# EAGLE design SR_Presentation_Version (EAGLE 9.2.0)
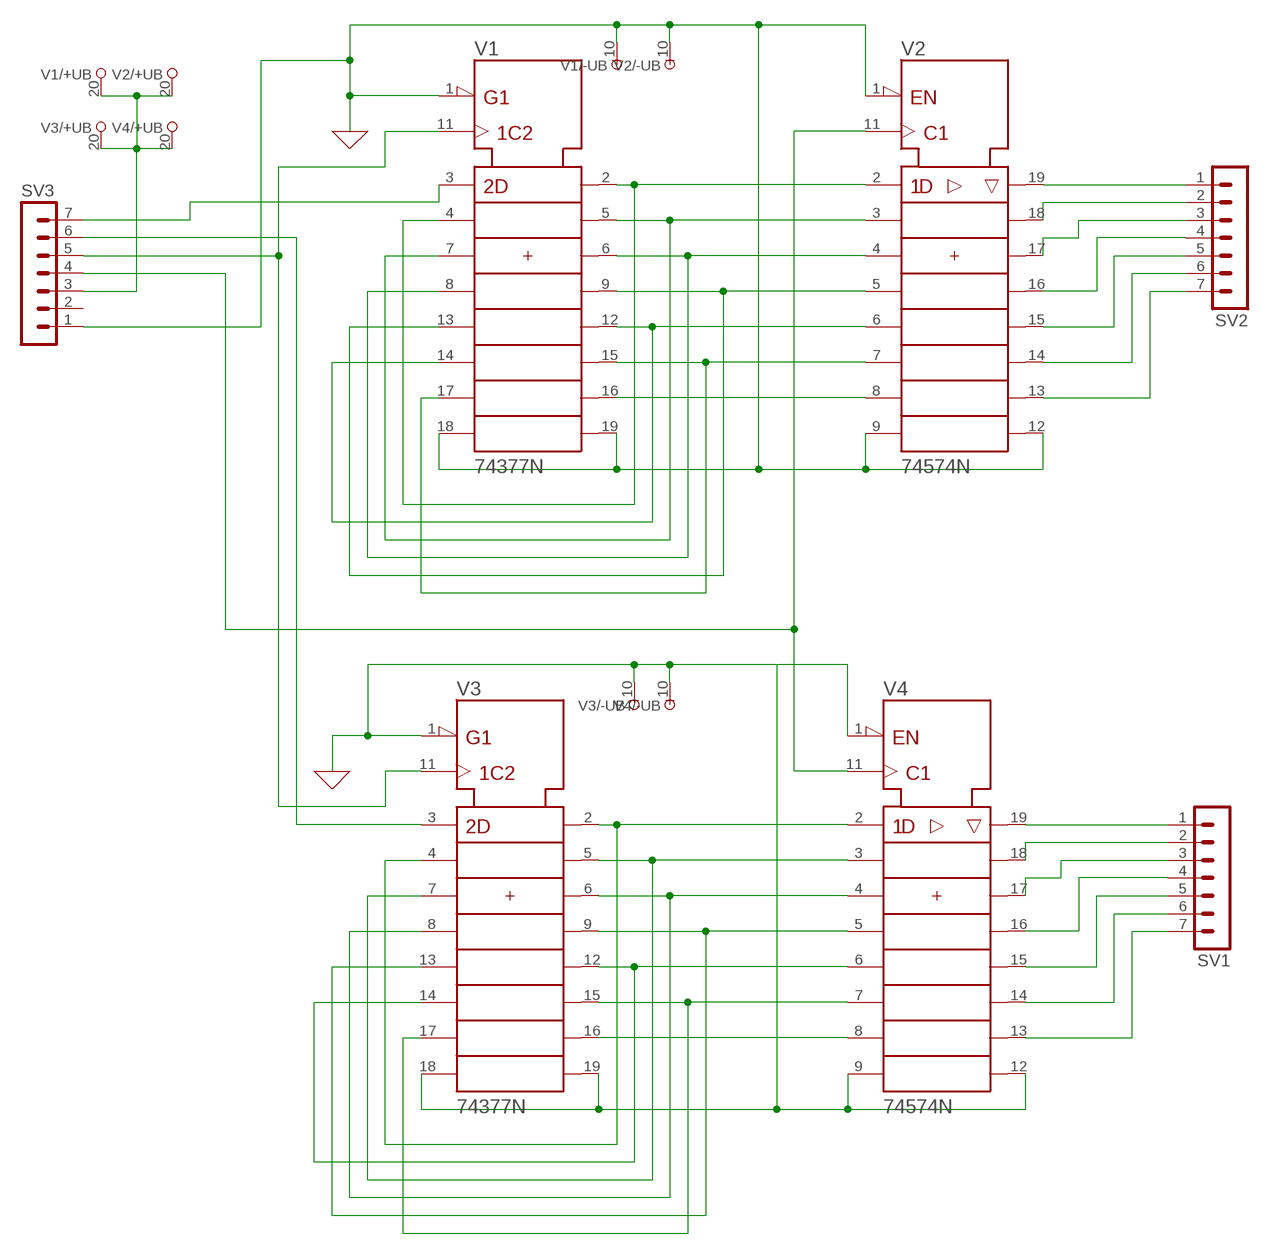
[diagram p0: schematic, sheet 1]

## Parts
SV1  MA07-1  [MA07-1]
SV2  MA07-1  [MA07-1]
SV3  MA07-1  [MA07-1]
V1  74377N  [DIL20]
V2  74574N  [DIL20]
V3  74377N  [DIL20]
V4  74574N  [DIL20]

## Nets
0: SV3.1 V1.1(!G) V1.10(-UB) V1.18(8D) V1.19(8Q) V2.1(!OC) V2.9(8D) V2.10(-UB) V2.12(8Q) V3.1(!G) V3.10(-UB) V3.18(8D) V3.19(8Q) V4.1(!OC) V4.9(8D) V4.10(-UB) V4.12(8Q) ; supply symbol labelled GND
N$1: V1.2(1Q) V1.4(2D) V2.2(1D)
N$2: V1.5(2Q) V1.7(3D) V2.3(2D)
N$3: V1.6(3Q) V1.8(4D) V2.4(3D)
N$4: V1.9(4Q) V1.13(5D) V2.5(4D)
N$5: V1.12(5Q) V1.14(6D) V2.6(5D)
N$6: V1.15(6Q) V1.17(7D) V2.7(6D)
N$7: V1.16(7Q) V2.8(7D)
N$8: SV3.3 V1.20(+UB) V2.20(+UB) V3.20(+UB) V4.20(+UB)
N$9: SV3.4 V2.11(CLK) V4.11(CLK)
N$11: SV2.1 V2.19(1Q)
N$12: SV2.2 V2.18(2Q)
N$13: SV2.3 V2.17(3Q)
N$14: SV2.4 V2.16(4Q)
N$15: SV2.5 V2.15(5Q)
N$16: SV2.6 V2.14(6Q)
N$17: SV2.7 V2.13(7Q)
N$18: V3.2(1Q) V3.4(2D) V4.2(1D)
N$19: V3.5(2Q) V3.7(3D) V4.3(2D)
N$20: V3.6(3Q) V3.8(4D) V4.4(3D)
N$21: V3.9(4Q) V3.13(5D) V4.5(4D)
N$22: V3.12(5Q) V3.14(6D) V4.6(5D)
N$23: V3.15(6Q) V3.17(7D) V4.7(6D)
N$24: V3.16(7Q) V4.8(7D)
N$25: SV1.1 V4.19(1Q)
N$26: SV1.2 V4.18(2Q)
N$27: SV1.3 V4.17(3Q)
N$28: SV1.4 V4.16(4Q)
N$29: SV1.5 V4.15(5Q)
N$30: SV1.6 V4.14(6Q)
N$31: SV1.7 V4.13(7Q)
N$32: SV3.7 V1.3(1D)
N$33: SV3.6 V3.3(1D)
N$36: SV3.5 V1.11(CLK) V3.11(CLK)
Unconnected: SV3.2

## Library data of the parts
SV1-SV3 = con-lstb:MA07-1: PIN HEADER; OC_FARNELL: unknown; OC_NEWARK: unknown
V1 V3 = 74ttl-din:74*377: Octal D type FLIP FLOP, enable
V2 V4 = 74ttl-din:74*574: 8-bit D type FLIP FLOP bus driver

## Board
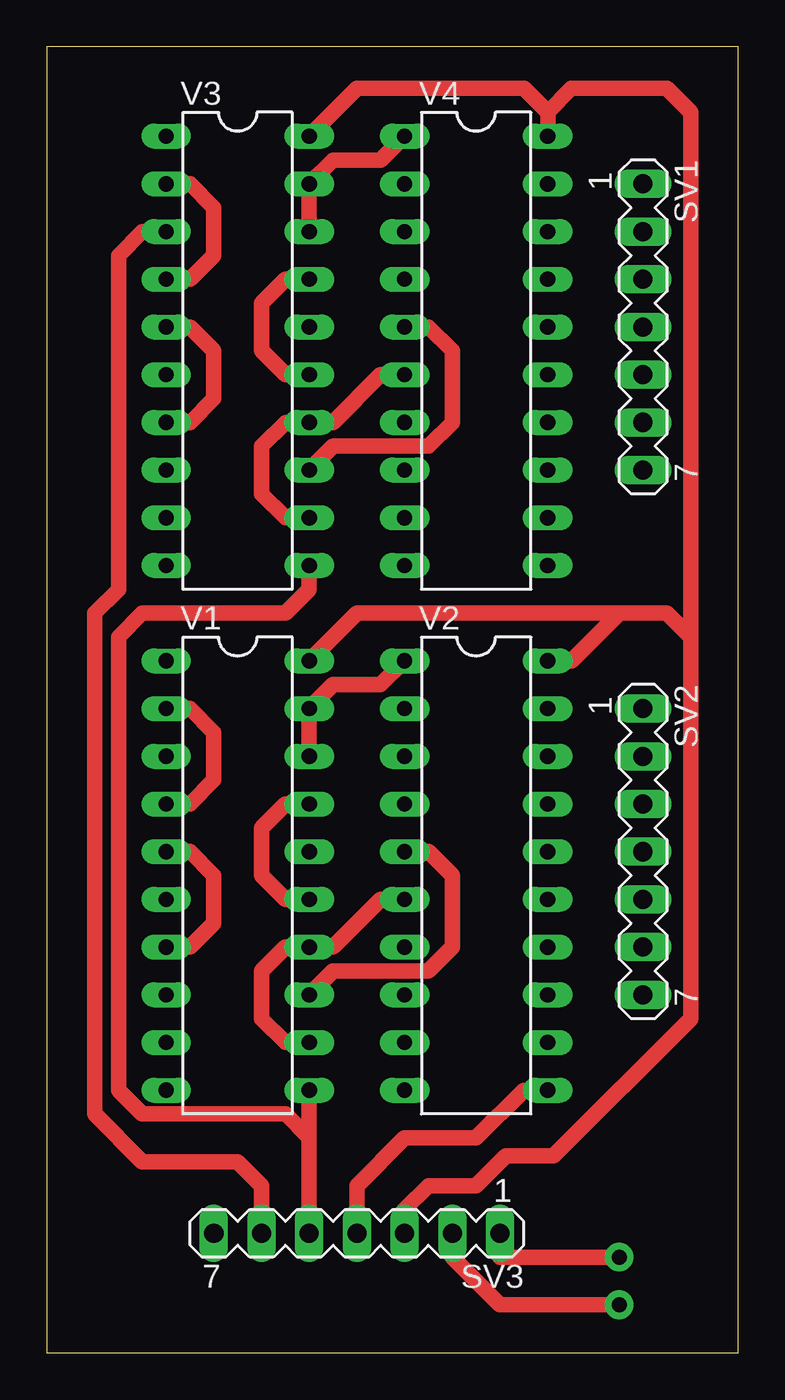
[diagram p1: board, top side]
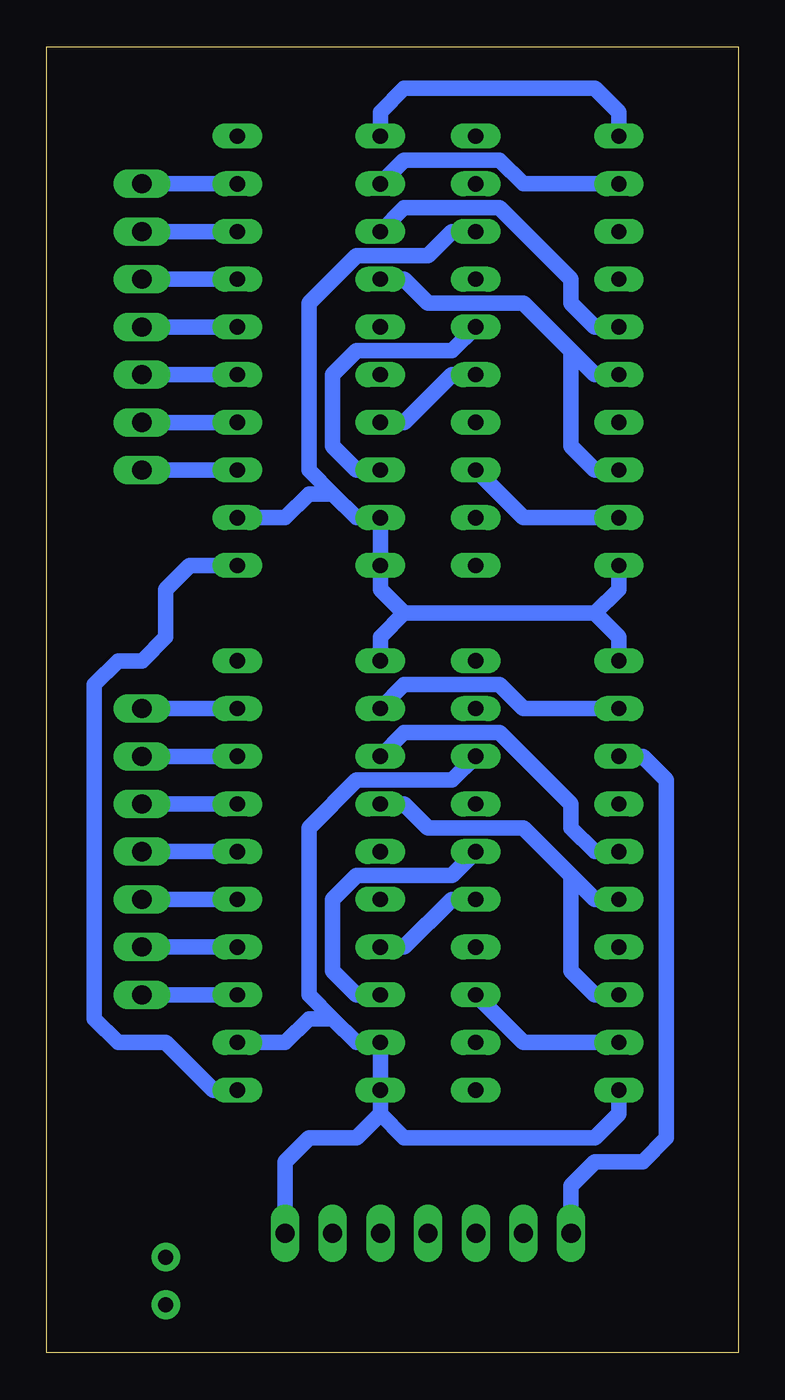
[diagram p2: board, bottom side, seen from below]

Size 36.81 x 69.52 mm. Coordinates in mm from the lower left corner, seen from the top.
Outline: 0,0 36.81,0 36.81,69.52 0,69.52 0,0
Copper layers (1*16): Top 0.035mm / dielectric 1.5mm / Bottom 0.035mm
Design rules "default": minimum track width 6mil, minimum drill 0.35mm, track to track 6mil, track to pad 6mil, pad to pad 6mil, via to via 6mil, smd to smd 6mil, copper to edge 40mil, drill to drill 6mil, minimum pad ring 10mil, minimum via ring 8mil, stop-mask expansion 4mil, vias tented up to drill 0mil, thermal gap 10mil

### Footprints (pad centres in the part's own frame; a part is rotated, then mirrored left to right if it is on the bottom)
MA07-1 = drill 1.016 long: 1 -7.62,0; 2 -5.08,0; 3 -2.54,0; 4 0,0; 5 2.54,0; 6 5.08,0; 7 7.62,0
DIL20 = drill 0.813 long: 1 -11.43,-3.81; 2 -8.89,-3.81; 3 -6.35,-3.81; 4 -3.81,-3.81; 5 -1.27,-3.81; 6 1.27,-3.81; 7 3.81,-3.81; 8 6.35,-3.81; 9 8.89,-3.81; 10 11.43,-3.81; 11 11.43,3.81; 12 8.89,3.81; 13 6.35,3.81; 14 3.81,3.81; 15 1.27,3.81; 16 -1.27,3.81; 17 -3.81,3.81; 18 -6.35,3.81; 19 -8.89,3.81; 20 -11.43,3.81

### Placement (x,y rotation side)
SV1  31.75,54.61 270 top
SV2  31.75,26.67 270 top
SV3  16.51,6.35 180 top
V1  10.16,25.4 270 top
V2  22.86,25.4 270 top
V3  10.16,53.34 270 top
V4  22.86,53.34 270 top

### Tracks (layer width: path | path; a pad name or v marks a point on that pad's centre or on a via)
0
  Top 0.813: V3.18 V3.19 15.24,63.5 17.78,63.5 V4.1 | V2.1 17.78,35.56 15.24,35.56 V1.19 V1.18 | SV3.1 24.13,5.08 30.48,5.08
  Bottom 0.813: V3.1 6.35,66.04 7.62,67.31 17.78,67.31 19.05,66.04 V4.1 | V3.10 6.35,40.64 7.62,39.37 | V1.1 6.35,38.1 7.62,39.37 | 7.62,39.37 17.78,39.37 | 17.78,39.37 19.05,38.1 V2.1 | 17.78,39.37 19.05,40.64 V4.10 V4.9 20.32,44.45 21.59,45.72 | V3.18 15.24,59.69 16.51,58.42 20.32,58.42 22.86,55.88 22.86,46.99 21.59,45.72 | V4.12 24.13,44.45 22.86,45.72 21.59,45.72 | 21.59,17.78 20.32,16.51 V2.9 V2.10 19.05,12.7 | 21.59,17.78 22.86,19.05 22.86,27.94 20.32,30.48 15.24,30.48 V1.18 | V1.10 6.35,12.7 7.62,11.43 17.78,11.43 19.05,12.7 | V2.12 24.13,16.51 22.86,17.78 21.59,17.78 | 19.05,12.7 20.32,11.43 22.86,11.43 24.13,10.16 SV3.1
N$1
  Top 0.813: V1.2 7.62,34.29 8.89,33.02 8.89,30.48 7.62,29.21 V1.4
  Bottom 0.813: V1.2 11.43,34.29 12.7,35.56 17.78,35.56 V2.2
N$2
  Top 0.813: V1.5 7.62,26.67 8.89,25.4 8.89,22.86 7.62,21.59 V1.7
  Bottom 0.813: V1.5 7.62,26.67 8.89,27.94 8.89,29.21 12.7,33.02 17.78,33.02 V2.3
N$3
  Bottom 0.813: V1.8 7.62,19.05 8.89,20.32 8.89,25.4 | 8.89,25.4 11.43,27.94 16.51,27.94 17.78,29.21 V2.4 | 8.89,25.4 7.62,24.13 V1.6
N$4
  Top 0.813: V1.13 15.24,20.32 20.32,20.32 21.59,21.59 21.59,25.4 20.32,26.67 V2.5
  Bottom 0.813: V1.13 11.43,16.51 V1.9
N$5
  Top 0.813: V1.12 12.7,16.51 11.43,17.78 11.43,20.32 12.7,21.59 V1.14 15.24,21.59 17.78,24.13 V2.6
N$6
  Top 0.813: V1.17 12.7,29.21 11.43,27.94 11.43,25.4 12.7,24.13 V1.15
  Bottom 0.813: V1.15 15.24,24.13 17.78,21.59 V2.7
N$7
  Bottom 0.813: V1.16 15.24,25.4 20.32,25.4 21.59,24.13 21.59,20.32 20.32,19.05 V2.8
N$8
  Top 0.813: V3.20 16.51,67.31 25.4,67.31 26.67,66.04 | 26.67,66.04 V4.20 | V2.20 27.94,36.83 30.48,39.37 | V1.20 16.51,39.37 30.48,39.37 | 26.67,66.04 27.94,67.31 33.02,67.31 34.29,66.04 34.29,38.1 | 34.29,38.1 34.29,17.78 26.98,10.46 24.44,10.46 22.86,8.89 20.32,8.89 19.05,7.62 SV3.3 | 34.29,38.1 33.02,39.37 30.48,39.37
N$9
  Top 0.813: SV3.4 16.51,8.89 19.05,11.43 22.86,11.43 25.4,13.97 V2.11
  Bottom 0.813: V4.11 29.21,41.91 30.48,40.64 30.48,38.1 31.75,36.83 33.02,36.83 34.29,35.56 34.29,17.78 33.02,16.51 30.48,16.51 27.94,13.97 V2.11
N$10  (via drill 0.8 pad 1.52)
  Top 0.813: v30.48,2.54 24.13,2.54 21.59,5.08 21.59,6.35
N$11
  Bottom 0.813: SV2.1 V2.19
N$12
  Bottom 0.813: SV2.2 V2.18
N$13
  Bottom 0.813: SV2.3 V2.17
N$14
  Bottom 0.813: SV2.4 V2.16
N$15
  Bottom 0.813: SV2.5 V2.15
N$16
  Bottom 0.813: SV2.6 V2.14
N$17
  Bottom 0.813: SV2.7 V2.13
N$18
  Top 0.813: V3.2 7.62,62.23 8.89,60.96 8.89,58.42 7.62,57.15 V3.4
  Bottom 0.813: V3.2 11.43,62.23 12.7,63.5 17.78,63.5 V4.2
N$19
  Top 0.813: V3.5 7.62,54.61 8.89,53.34 8.89,50.8 7.62,49.53 V3.7
  Bottom 0.813: V4.3 17.78,60.96 12.7,60.96 8.89,57.15 8.89,55.88 7.62,54.61 V3.5
N$20
  Bottom 0.813: V3.8 7.62,46.99 8.89,48.26 8.89,53.34 | V3.6 7.62,52.07 8.89,53.34 | V4.4 17.78,57.15 16.51,55.88 11.43,55.88 8.89,53.34
N$21
  Top 0.813: V3.13 15.24,48.26 20.32,48.26 21.59,49.53 21.59,53.34 20.32,54.61 V4.5
  Bottom 0.813: V3.9 11.43,44.45 V3.13
N$22
  Top 0.813: V4.6 17.78,52.07 15.24,49.53 V3.14 12.7,49.53 11.43,48.26 11.43,45.72 12.7,44.45 V3.12
N$23
  Top 0.813: V3.17 12.7,57.15 11.43,55.88 11.43,53.34 12.7,52.07 V3.15
  Bottom 0.813: V3.15 15.24,52.07 17.78,49.53 V4.7
N$24
  Bottom 0.813: V3.16 15.24,53.34 20.32,53.34 21.59,52.07 21.59,48.26 20.32,46.99 V4.8
N$25
  Bottom 0.813: SV1.1 V4.19
N$26
  Bottom 0.813: SV1.2 V4.18
N$27
  Bottom 0.813: SV1.3 V4.17
N$28
  Bottom 0.813: SV1.4 V4.16
N$29
  Bottom 0.813: SV1.5 V4.15
N$30
  Bottom 0.813: SV1.6 V4.14
N$31
  Bottom 0.813: SV1.7 V4.13
N$32
  Bottom 0.813: SV3.7 8.89,8.89 7.62,10.16 5.08,10.16 3.81,11.43 3.81,30.48 5.08,31.75 V1.3
N$33
  Top 0.813: V3.3 5.08,59.69 3.81,58.42 3.81,40.64 2.54,39.37 2.54,12.7 5.08,10.16 10.16,10.16 11.43,8.89 SV3.6
N$34  (via drill 0.8 pad 1.52)
  other vias: 30.48,5.08
N$36
  Top 0.813: V1.11 13.97,11.43 | V3.11 13.97,40.64 12.7,39.37 5.08,39.37 3.81,38.1 3.81,13.97 5.08,12.7 12.7,12.7 13.97,11.43 | 13.97,11.43 SV3.5